# Altium schematic sheet SolarPanel.SchDoc
size A
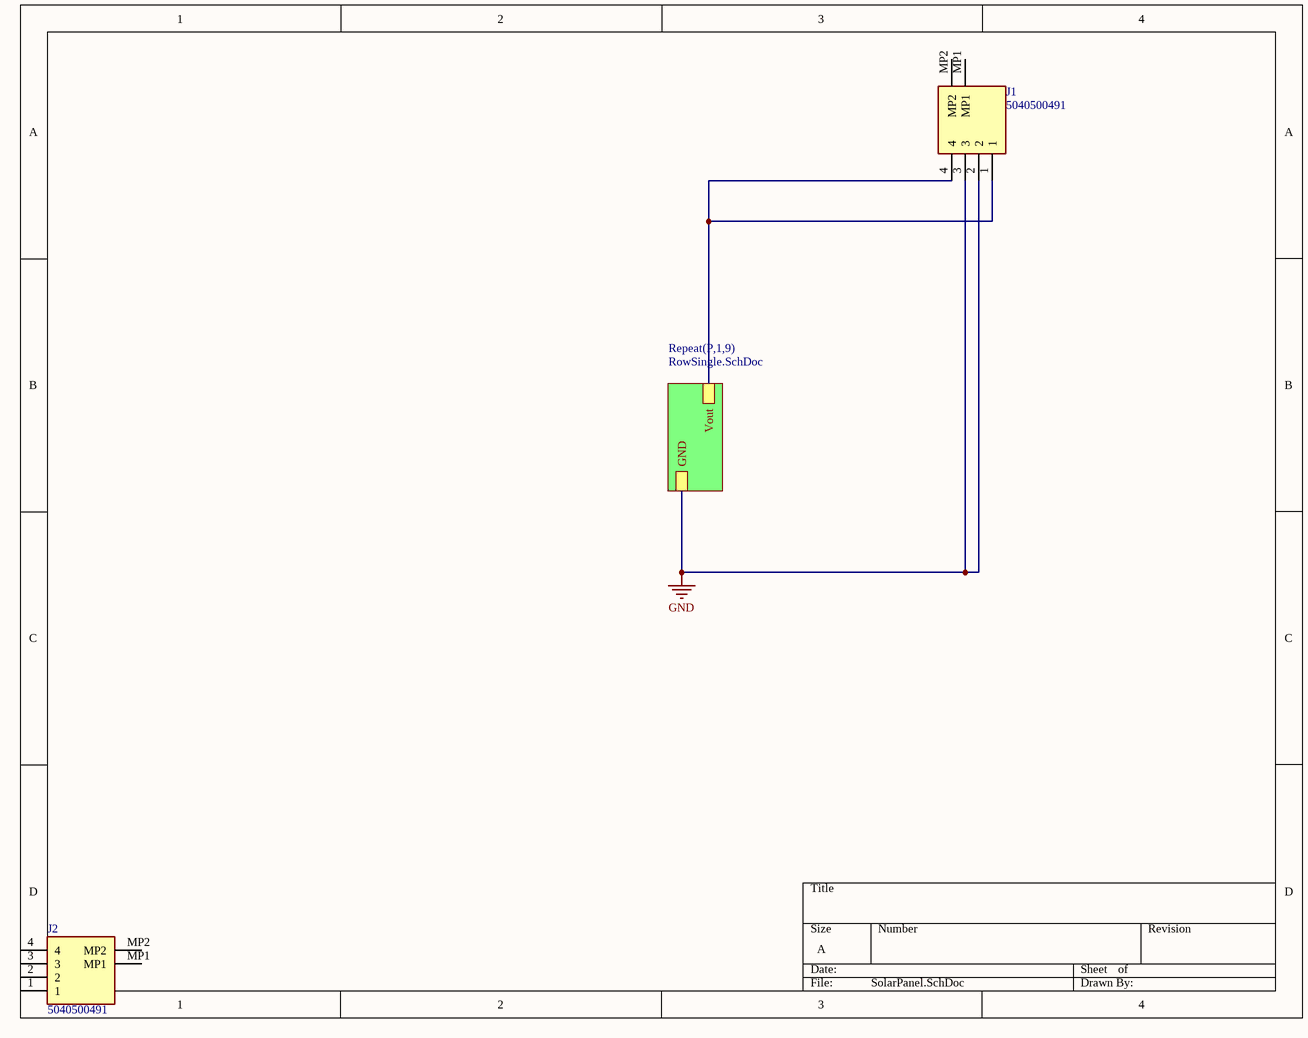
[diagram p0: SolarPanel.SchDoc]

## Parts
J1  5040500491  [5040500491]
J2  5040500491  [5040500491]

## Sub-sheets
Repeat(P,1,9) = RowSingle.SchDoc: Vout, GND

## Nets
GND: J1.2 J1.3 ; sheet Repeat(P,1,9)/GND
NetJ1_1: J1.1 J1.4 ; sheet Repeat(P,1,9)/Vout

Not connected (* = marked no-connect by the designer): J1 MP1 MP2; J2 1 2 3 4 MP1 MP2

## Library data of the parts
J1 J2 = 5040500491: Connector; Manufacturer_Name: Molex; Allied_Number: 70331790; Datasheet Link: https://www.molex.com/pdm_docs/sd/5040500691_sd.pdf; Height: 2.15mm; Manufacturer_Part_Number: 5040500491; Allied Price/Stock: https://www.alliedelec.com/molex-incorporated-5040500491/70331790/